# EAGLE schematic V4-AddRS485-V01-012 (EAGLE 9.1.1)
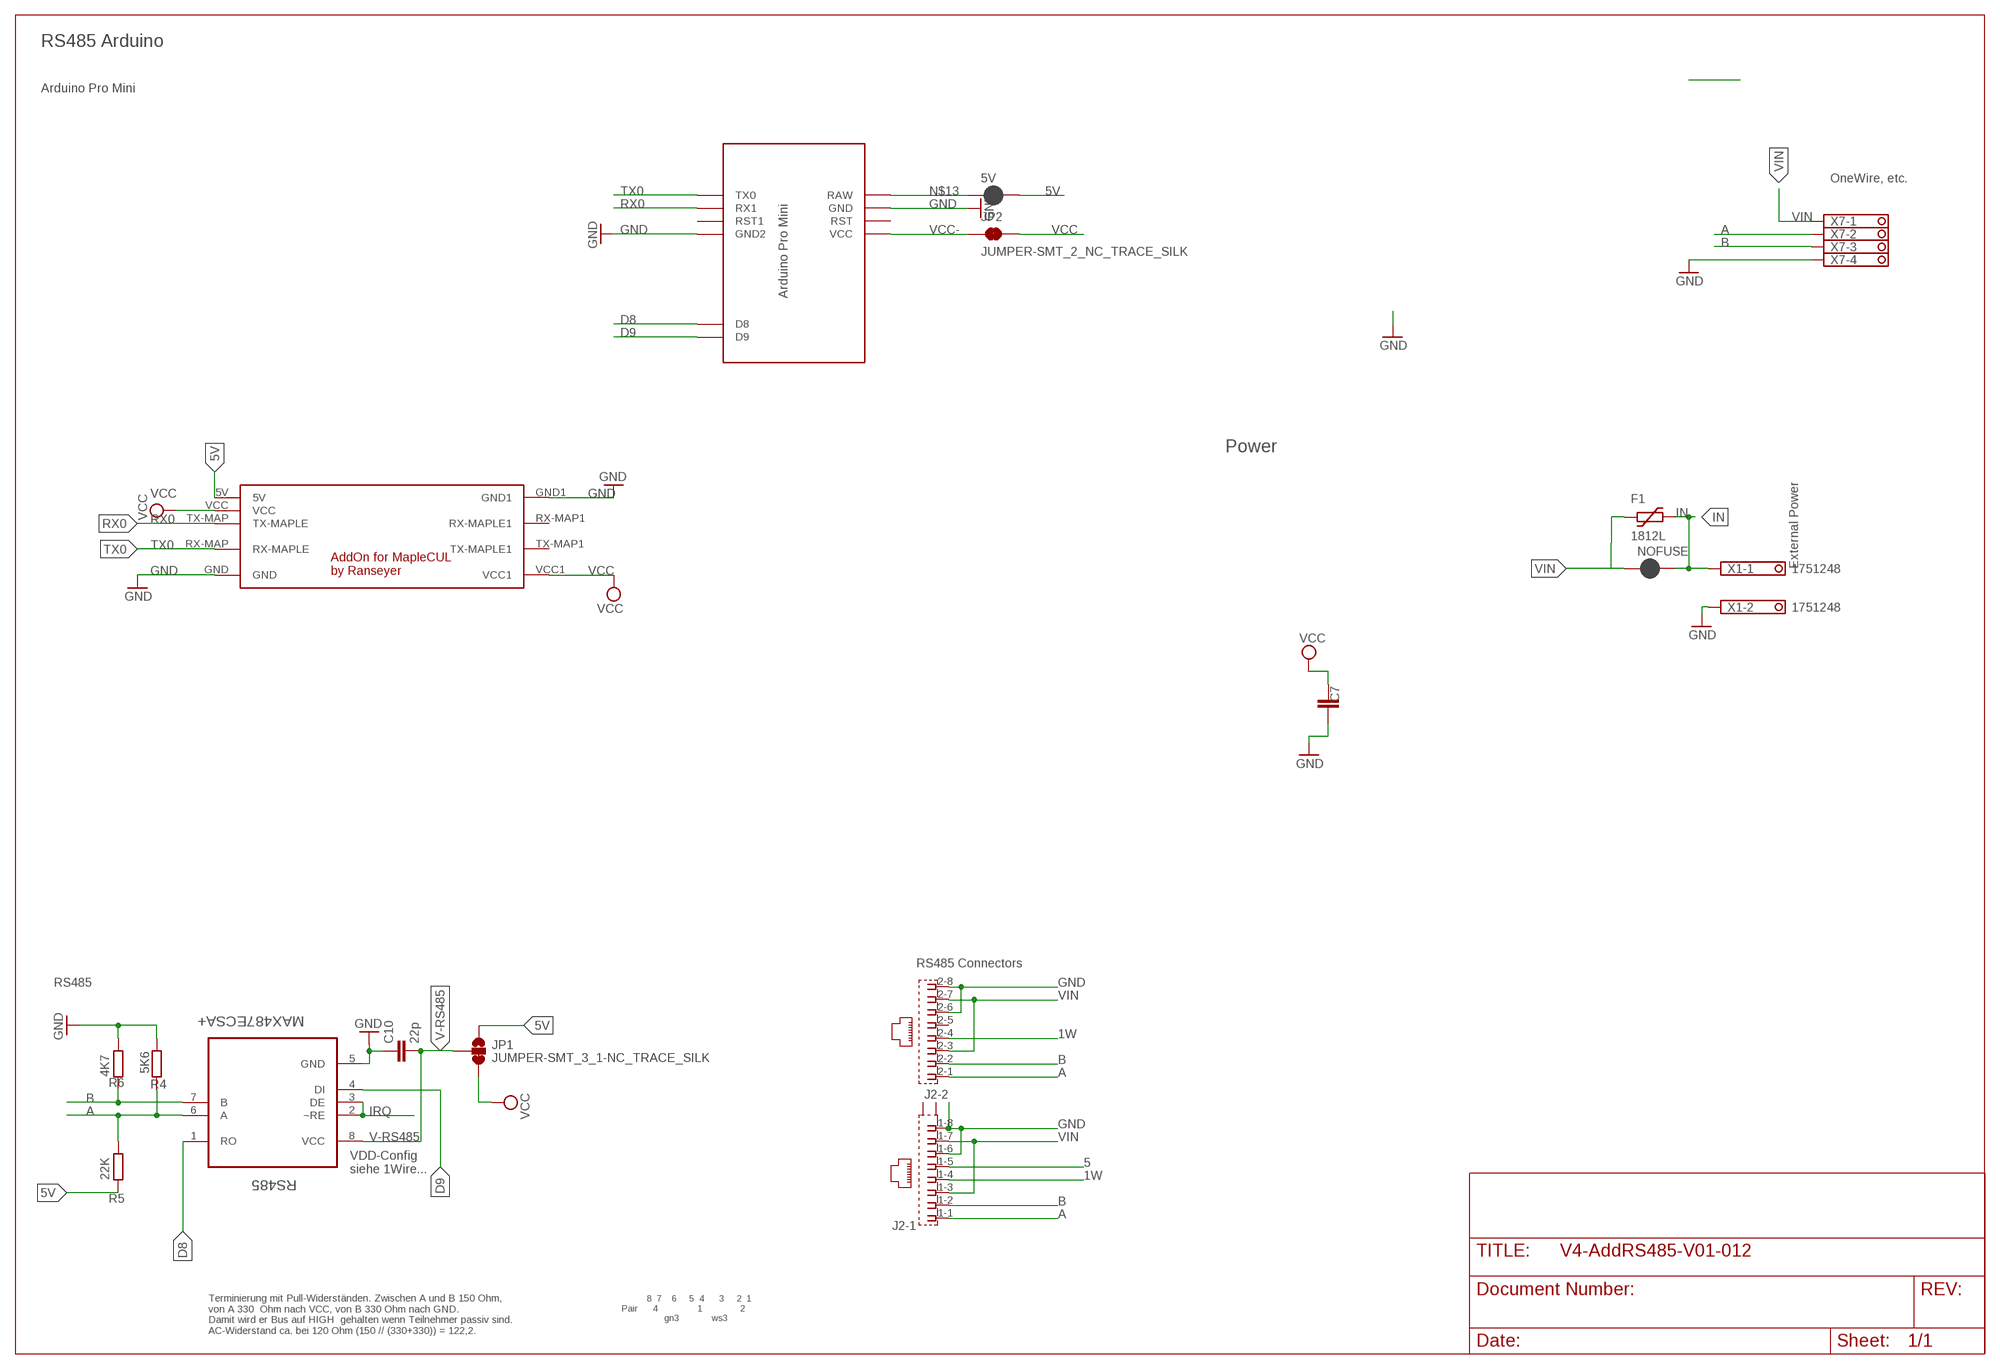
[diagram p0: schematic, sheet 1]

## Parts
5V  JUMPER-SMT_2_NC_PASTE_NO-SILK  [SMT-JUMPER_2_NC_PASTE_NO-SILK]
C7  C-EUC1812  [C1812]
C10  22p  C-EUC0805  [C0805]
F1  1812L  [1812L]
J2  RJ45_2X_S  [RJ45_2X_S]
JP1  JUMPER-SMT_3_1-NC_TRACE_SILK  [SMT-JUMPER_3_1-NC_TRACE_SILK]
JP2  JUMPER-SMT_2_NC_TRACE_SILK  [SMT-JUMPER_2_NC_TRACE_SILK]
NOFUSE  JUMPER-SMT_2_NC_PASTE_NO-SILK  [SMT-JUMPER_2_NC_PASTE_NO-SILK]
R4  5K6  R-EU_R0805  [R0805]
R5  22K  R-EU_R0805  [R0805]
R6  4K7  R-EU_R0805  [R0805]
RS485  MAX487ECSA+  [SOIC127P600X175-8N]
U$2  MAPLE-CUL-ADDON-V01  [MAPLE-CUL-V01]
U$3  MARTIN-PRO-MINI-RS485  [MARTIN-PRO-MINI-RS485]
X1  1751248  [1751248]
X7  1751264  [1751264]

## Nets
1W: J2.1-4 J2.2-4
5: J2.1-5
5V: 5V.2 JP1.1 R5.1 U$2.5V
A: J2.1-1 J2.2-1 R4.2 R5.2 RS485.6(A) X7.2
B: J2.1-2 J2.2-2 R6.1 RS485.7(B) X7.3
D8: RS485.1(RO) U$3.D8
D9: RS485.4(DI) U$3.D9
GND [PWR]: C7.1 C10.1 J2.1-6 J2.1-8 J2.2-6 J2.2-8 R4.1 R6.2 RS485.5(GND) U$2.GND U$2.GND1 U$3.GND U$3.GND1(GND2) X1.2 X7.4
IN [PWR]: F1.P$2 NOFUSE.2 X1.1
IRQ: RS485.2(~RE) RS485.3(DE)
N$13: 5V.1 U$3.RAW
RX0: U$2.TX-MAP(TX-MAPLE) U$3.RX1
TX0: U$2.RX-MAP(RX-MAPLE) U$3.TX0
V-RS485 [PWR]: C10.2 JP1.2 RS485.8(VCC)
VCC [PWR]: C7.2 JP1.3 JP2.2 U$2.VCC U$2.VCC1
VCC- [PWR]: JP2.1 U$3.VCC
VIN [PWR]: F1.P$1 J2.1-3 J2.1-7 J2.2-3 J2.2-7 NOFUSE.1 X7.1
Unconnected: J2.2-5 J2.G1(-1:S2) J2.G3(-1:S1) U$2.RX-MAP1(RX-MAPLE1) U$2.TX-MAP1(TX-MAPLE1) U$3.RST U$3.RST1

## Notes on the sheet
- RS485 Arduino
- Arduino Pro Mini
- OneWire, etc.
- Power
- External Power
- RS485 Connectors
- RS485
- VDD-Config
  siehe 1Wire...
- 8  7    6     5  4      3     2  1
  Pair      4                1               2
                   gn3             ws3
- Terminierung mit Pull-Widerständen. Zwischen A und B 150 Ohm,
  von A 330  Ohm nach VCC, von B 330 Ohm nach GND. 
  Damit wird er Bus auf HIGH  gehalten wenn Teilnehmer passiv sind.
  AC-Widerstand ca. bei 120 Ohm (150 // (330+330)) = 122,2.

## Library data of the parts
5V NOFUSE = SparkFun-Jumpers:JUMPER-SMT_2_NC_PASTE: Normally closed solder jumper This jumper has an aperture in the stencil to allow solder paste to bridge the split in the wire so it's normally closed (NC). Wick off the solder to open the connection. Reapply solder to reclose the connection.
C7 = rcl:C-EU: CAPACITOR, European symbol; SPICEPREFIX: C
C10 = rcl:C-EU: CAPACITOR, European symbol
F1 = ptc-littlefuse:1812L
J2 = RJ45:RJ45_2X_S: AMP connector
JP1 = SparkFun-Jumpers:JUMPER-SMT_3_1-NC_TRACE: Normally closed trace jumper (1 of 2 connections) This jumper has a trace between two pads so it's normally closed (NC). The other connection is normally open (NO). Use a razor knife to open the connection. For best results follow the IPC guidelines for cutting traces: Cutout at least 0.063 mm (0.005 in). Remove all loose material to clean up the cut area. Seal the cut with an approved epoxy. Reapply solder to reclose the connection, or to close the NO connection.
JP2 = SparkFun-Jumpers:JUMPER-SMT_2_NC_TRACE: Normally closed trace jumper This jumper has a trace between two pads so it's normally closed (NC). Use a razor knife to open the connection. For best results follow the IPC guidelines for cutting traces: Cutout at least 0.063 mm (0.005 in). Remove all loose material to clean up the cut area. Seal the cut with an approved epoxy. Reapply solder to reclose the connection.
R4-R6 = rcl:R-EU_: RESISTOR, European symbol
RS485 = Maxim_By_element14_Batch_1:MAX487ECSA+: Low-Power, Slew-Rate-Limited RS-485/RS-422 Transceivers; MPN: MAX487ECSA+; OC_FARNELL: 9724532; OC_NEWARK: 68K4803; PACKAGE: SOIC-8; SUPPLIER: Maxim
U$2 = Martin-Communication-V4:MAPLE-CUL-ADDON-V01: AddOn for MAPLE-CUL V4.x
U$3 = Arduino-clone:MARTIN-PRO-MINI-RS485: ABK Pro-Mini Arduino Clone
X1 = con-phoenix-350:1751248: MKDS 1/ 2-3,5 Printklemme Nennstrom: 10 A Bemessungsspannung: 160 V Raster: 3,5 mm Polzahl: 2 Montageart: Löten Anschlussart: Schraubanschluss Anschlussrichtung vom Leiter zur Platine: 0° Source: http://eshop.phoenixcontact.com .. 1751248.pdf; OC_FARNELL: unknown; OC_NEWARK: unknown
X7 = con-phoenix-350:1751264: MKDS 1/ 4-3,5 Printklemme Nennstrom: 10 A Bemessungsspannung: 160 V Raster: 3,5 mm Polzahl: 4 Montageart: Löten Anschlussart: Schraubanschluss Anschlussrichtung vom Leiter zur Platine: 0° Source: http://eshop.phoenixcontact.com .. 1751264.pdf; MPN: 1751264; OC_FARNELL: unknown; OC_NEWARK: 10R0934

## Net classes
0 default: width 0.254 mm
1 PWR: width 0.305 mm